# Altium schematic sheet Charger_BIC_V01.SchDoc
size A4
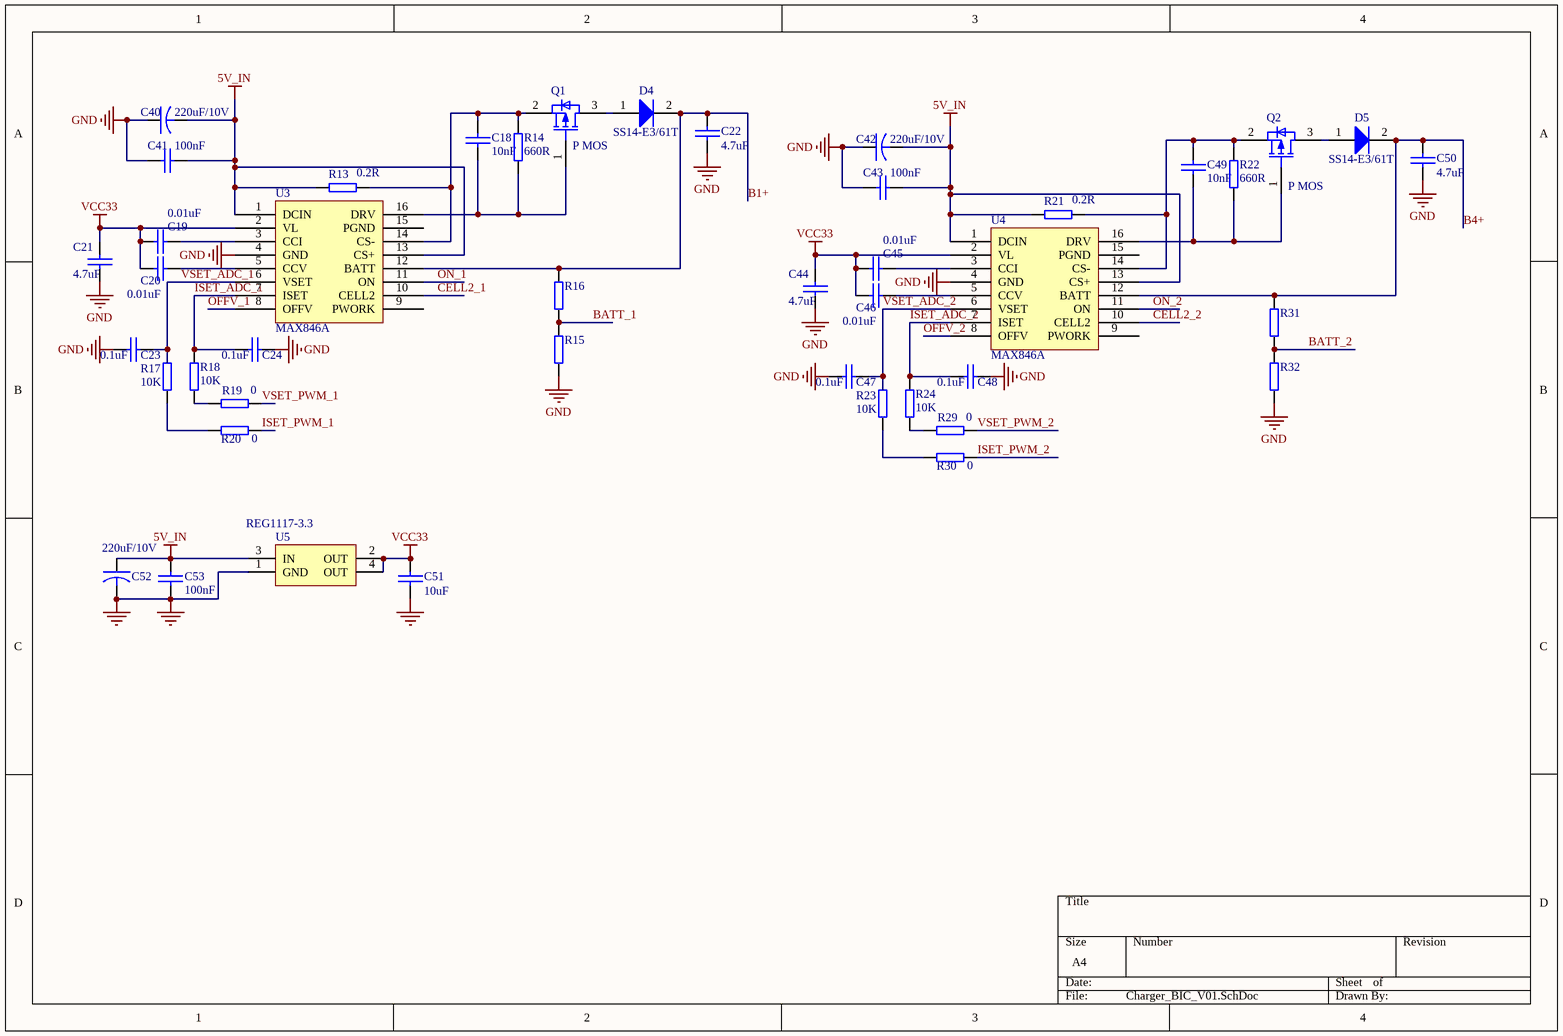
[diagram p0: Charger_BIC_V01.SchDoc]

## Parts
C18  value 10nF  [C0603]  (hidden comment: C0603)
C19  value 0.01uF  [C0603]  (hidden comment: C0603)
C20  value 0.01uF  [C0603]  (hidden comment: C0603)
C21  value 4.7uF  [C0603]  (hidden comment: C0603)
C22  value 4.7uF  [C0805]  (hidden comment: C0805)
C23  value 0.1uF  [C0603]  (hidden comment: C0603)
C24  value 0.1uF  [C0603]  (hidden comment: C0603)
C40  value 220uF/10V  [C6032]  (hidden comment: TAJC227K010RNJ)
C41  value 100nF  [C0603]  (hidden comment: CC0603ZRY5V9BB104)
C42  value 220uF/10V  [C6032]  (hidden comment: TAJC227K010RNJ)
C43  value 100nF  [C0603]  (hidden comment: CC0603ZRY5V9BB104)
C44  value 4.7uF  [C0603]  (hidden comment: C0603)
C45  value 0.01uF  [C0603]  (hidden comment: C0603)
C46  value 0.01uF  [C0603]  (hidden comment: C0603)
C47  value 0.1uF  [C0603]  (hidden comment: C0603)
C48  value 0.1uF  [C0603]  (hidden comment: C0603)
C49  value 10nF  [C0603]  (hidden comment: C0603)
C50  value 4.7uF  [C0805]  (hidden comment: C0805)
C51  value 10uF  [C0805]  (hidden comment: CC0805ZKY5V6BB106)
C52  value 220uF/10V  [C6032]  (hidden comment: TAJC227K010RNJ)
C53  value 100nF  [C0603]  (hidden comment: CC0603ZRY5V9BB104)
D4  SS14-E3/61T  [D3528]
D5  SS14-E3/61T  [D3528]
Q1  P MOS  [SOT23]
Q2  P MOS  [SOT23]
R13  value 0.2R  [R0603]  (hidden comment: R0603)
R14  value 660R  [R0603]  (hidden comment: RC0603JR-0720KL)
R15  R0603  [R0603]  (value not drawn)
R16  R0603  [R0603]  (value not drawn)
R17  value 10K  [R0603]  (hidden comment: RC0603JR-0710KL)
R18  value 10K  [R0603]  (hidden comment: RC0603JR-0710KL)
R19  value 0  [R0603]  (hidden comment: R0603)
R20  value 0  [R0603]  (hidden comment: R0603)
R21  value 0.2R  [R0603]  (hidden comment: R0603)
R22  value 660R  [R0603]  (hidden comment: RC0603JR-0720KL)
R23  value 10K  [R0603]  (hidden comment: RC0603JR-0710KL)
R24  value 10K  [R0603]  (hidden comment: RC0603JR-0710KL)
R29  value 0  [R0603]  (hidden comment: R0603)
R30  value 0  [R0603]  (hidden comment: R0603)
R31  R0603  [R0603]  (value not drawn)
R32  R0603  [R0603]  (value not drawn)
U3  MAX846A  [QSOP16]
U4  MAX846A  [QSOP16]
U5  value REG1117-3.3  [SOT223]  (hidden comment: REG1117-3.3/2K5)

## Nets
5V_IN: C40.2 C41.1 C42.2 C43.1 C52.1 C53.2 R13.2 R21.2 U3.1(DCIN) U3.13(CS+) U4.1(DCIN) U4.13(CS+) U5.3(IN)
GND: C21.2 C22.2 C23.1 C24.2 C40.1 C41.2 C42.1 C43.2 C44.2 C47.1 C48.2 C50.2 C51.2 C52.2 C53.1 R15.1 R32.1 U3.4(GND) U4.4(GND) U5.1(GND)
VCC33: C19.1 C20.1 C21.1 C44.1 C45.1 C46.1 C51.1 U3.2(VL) U4.2(VL) U5.2(OUT) U5.4(OUT)
B1+: C22.1 D4.2 R16.2 U3.12(BATT)
B4+: C50.1 D5.2 R31.2 U4.12(BATT)
BATT_1: R15.2 R16.1
BATT_2: R31.1 R32.2
CELL2_1: U3.10(CELL2)
CELL2_2: U4.10(CELL2)
ISET_ADC_1: C24.1 R18.1 U3.7(ISET)
ISET_ADC_2: C48.1 R24.1 U4.7(ISET)
ISET_PWM_1: R20.1
ISET_PWM_2: R30.1
OFFV_1: U3.8(OFFV)
OFFV_2: U4.8(OFFV)
ON_1: U3.11(ON)
ON_2: U4.11(ON)
VSET_ADC_1: C23.2 R17.1 U3.6(VSET)
VSET_ADC_2: C47.2 R23.1 U4.6(VSET)
VSET_PWM_1: R19.1
VSET_PWM_2: R29.1
NetC18_1: C18.1 Q1.1(G) R14.1 U3.16(DRV)
NetC18_2: C18.2 Q1.2(S) R13.1 R14.2 U3.14(CS-)
NetC19_2: C19.2 U3.3(CCI)
NetC20_2: C20.2 U3.5(CCV)
NetC45_2: C45.2 U4.3(CCI)
NetC46_2: C46.2 U4.5(CCV)
NetC49_1: C49.1 Q2.1(G) R22.1 U4.16(DRV)
NetC49_2: C49.2 Q2.2(S) R21.1 R22.2 U4.14(CS-)
NetD4_1: D4.1 Q1.3(D)
NetD5_1: D5.1 Q2.3(D)
NetR17_2: R17.2 R20.2
NetR18_2: R18.2 R19.2
NetR23_2: R23.2 R30.2
NetR24_2: R24.2 R29.2

Not connected (* = marked no-connect by the designer): U3 9(PWORK) 15(PGND); U4 9(PWORK) 15(PGND)

## Library data of the parts
C18-C21 C23 C24 C44-C49 = C0603: Unit Cost: 0.04
C40 C42 C52 = C6032_220uF_10V: CAP TANT 220UF 10V 10% 2312; Manufacturer: AVX Corporation; Unit Cost: 0.3; Category: Capacitors; Manufacturer Part Number: TAJC227K010RNJ; Part Number: TAJC227K010RNJ; RoHs: Lead free / RoHS Compliant; Subcategory: Tantalum Capacitors
C41 C43 C53 = C0603_100nF: CAP CER 0.1UF 50V Y5V 0603; Manufacturer: Yageo; Unit Cost: 0.04; Category: Capacitors; Manufacturer Part Number: CC0603ZRY5V9BB104; Part Number: CC0603ZRY5V9BB104; Subcategory: Ceramic Capacitors
C51 = C0805_10uF: CAP CER 10UF 10V Y5V 0805; Manufacturer: Yageo; Unit Cost: 0.08; Category: Capacitors; Manufacturer Part Number: CC0805ZKY5V6BB106; Part Number: CC0805ZKY5V6BB106; RoHs: Lead free / RoHS Compliant; Subcategory: Ceramic Capacitors
D4 D5 = D3528_SS14: DIODE SCHOTTKY 40V 1A DO214AC; Manufacturer: Vishay; Unit Cost: 0.2; Category: Diodes; Manufacturer Part Number: SS14-E3/61T; Part Number: SS14-E3/61T; Subcategory: Diodes, Rectifiers - Single; Value: SS14-E3/61T
Q1 Q2 = P MOS: MOS7002
R13 R15 R16 R19-R21 R29-R32 = R0603: Manufacturer: Yageo; Unit Cost: 0.005; Category: Resistor; RoHs: Lead free / RoHS Compliant; Subcategory: ThickFilm
R14 R22 = R0603_20K_5%: RES 20K OHM 1/10W 5% 0603 SMD; Manufacturer: Yageo; Unit Cost: 0.005; Category: Resistor; Manufacturer Part Number: RC0603JR-0720KL; Part Number: RC0603JR-0720KL; RoHs: Lead free / RoHS Compliant; Subcategory: ThickFilm
R17 R18 R23 R24 = R0603_10K_5%: RES 10K OHM 1/10W 5% 0603 SMD; Manufacturer: Yageo; Unit Cost: 0.005; Category: Resistor; Manufacturer Part Number: RC0603JR-0710KL; Part Number: RC0603JR-0710KL; RoHs: Lead free / RoHS Compliant; Subcategory: ThickFilm
U3 U4 = MAX846A: Battery-Charger
U5 = REG1117-3.3: IC REG LDO 3.3V 0.8A SOT223; Manufacturer: Texas Instruments; Category: Integrated Circuits (ICs); Manufacturer Part Number: REG1117-3.3/2K5; Part Number: REG1117-3.3/2K5; RoHs: Lead free / RoHS Compliant; Subcategory: PMIC - Voltage Regulators - Linear (LDO)